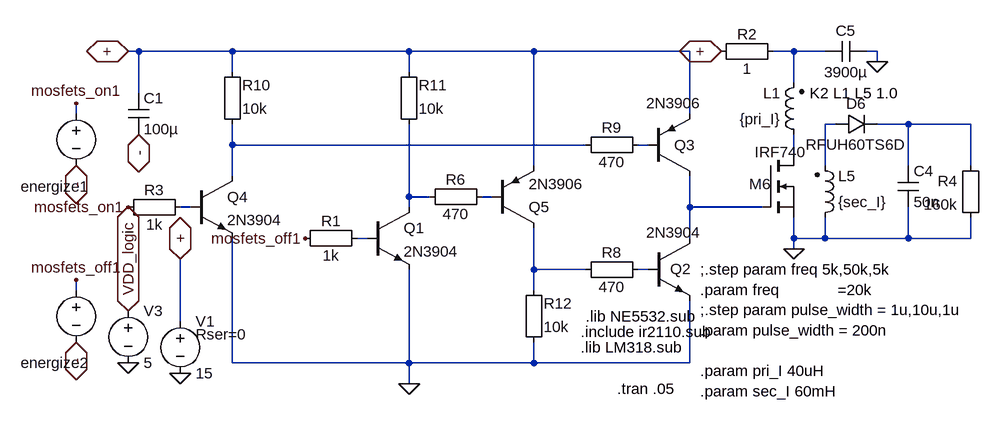
[diagram p0: schematic metal_SMPS_400v_2.asc]
metal_SMPS_400v_2.asc, the LTspice schematic file:
Version 4
SHEET 1 6068 1612
WIRE 2240 -2528 2224 -2528
WIRE 2384 -2528 2240 -2528
WIRE 2656 -2528 2384 -2528
WIRE 2848 -2528 2656 -2528
WIRE 3088 -2528 2848 -2528
WIRE 3248 -2528 3216 -2528
WIRE 3296 -2528 3248 -2528
WIRE 3376 -2528 3360 -2528
WIRE 3376 -2512 3376 -2528
WIRE 2384 -2496 2384 -2528
WIRE 2656 -2496 2656 -2528
WIRE 3248 -2480 3248 -2528
WIRE 2240 -2464 2240 -2528
WIRE 2144 -2432 2144 -2448
WIRE 3088 -2432 3088 -2528
WIRE 3312 -2416 3296 -2416
WIRE 3424 -2416 3376 -2416
WIRE 3520 -2416 3424 -2416
WIRE 2384 -2384 2384 -2416
WIRE 2928 -2384 2384 -2384
WIRE 3024 -2384 3008 -2384
WIRE 3248 -2368 3248 -2400
WIRE 2848 -2352 2848 -2528
WIRE 3296 -2352 3296 -2416
WIRE 3424 -2352 3424 -2416
WIRE 3520 -2352 3520 -2416
WIRE 2384 -2336 2384 -2384
WIRE 2656 -2304 2656 -2416
WIRE 2688 -2304 2656 -2304
WIRE 2784 -2304 2768 -2304
WIRE 2320 -2288 2304 -2288
WIRE 2656 -2288 2656 -2304
WIRE 3088 -2288 3088 -2336
WIRE 3200 -2288 3088 -2288
WIRE 2592 -2240 2576 -2240
WIRE 3088 -2240 3088 -2288
WIRE 3248 -2240 3248 -2272
WIRE 3296 -2240 3296 -2272
WIRE 3296 -2240 3248 -2240
WIRE 3424 -2240 3424 -2288
WIRE 3424 -2240 3296 -2240
WIRE 3520 -2240 3520 -2272
WIRE 3520 -2240 3424 -2240
WIRE 3248 -2224 3248 -2240
WIRE 2848 -2192 2848 -2256
WIRE 2928 -2192 2848 -2192
WIRE 3024 -2192 3008 -2192
WIRE 2144 -2160 2144 -2176
WIRE 2848 -2160 2848 -2192
WIRE 2304 -2112 2304 -2208
WIRE 2384 -2048 2384 -2240
WIRE 2656 -2048 2656 -2192
WIRE 2656 -2048 2384 -2048
WIRE 2848 -2048 2848 -2080
WIRE 2848 -2048 2656 -2048
WIRE 3088 -2048 3088 -2144
WIRE 3088 -2048 2848 -2048
WIRE 2656 -2016 2656 -2048
FLAG 3248 -2224 0
FLAG 2224 -2048 0
FLAG 2224 -2128 VDD_logic
IOPIN 2224 -2128 BiDir
FLAG 2304 -2208 +
IOPIN 2304 -2208 BiDir
FLAG 2304 -2032 0
FLAG 2144 -2352 -
IOPIN 2144 -2352 BiDir
FLAG 2144 -2448 mosfets_on1
FLAG 2144 -2080 -
IOPIN 2144 -2080 BiDir
FLAG 2144 -2176 mosfets_off1
FLAG 2240 -2400 -
IOPIN 2240 -2400 BiDir
FLAG 2224 -2288 mosfets_on1
FLAG 2496 -2240 mosfets_off1
FLAG 2224 -2528 +
IOPIN 2224 -2528 BiDir
FLAG 2656 -2016 0
FLAG 3376 -2512 0
FLAG 3136 -2528 +
IOPIN 3136 -2528 BiDir
SYMBOL ind2 3280 -2256 M180
WINDOW 0 36 80 Left 2
WINDOW 3 36 40 Left 2
SYMATTR InstName L5
SYMATTR Value {sec_I}
SYMATTR SpiceLine Rser=.42
SYMATTR Type ind
SYMBOL diode 3312 -2400 R270
WINDOW 0 32 32 VTop 2
WINDOW 3 0 32 VBottom 2
SYMATTR InstName D6
SYMATTR Value RFUH60TS6D
SYMBOL Misc\\EuropeanCap 3408 -2352 R0
SYMATTR InstName C4
SYMATTR Value 50n
SYMBOL Misc\\EuropeanResistor 3536 -2368 M0
SYMATTR InstName R4
SYMATTR Value 160k
SYMBOL nmos 3200 -2368 R0
WINDOW 0 -21 44 Left 2
WINDOW 3 -12 -5 Left 2
SYMATTR InstName M6
SYMATTR Value IRF740
SYMBOL ind2 3264 -2384 R180
WINDOW 0 36 80 Left 2
WINDOW 3 36 40 Left 2
SYMATTR InstName L1
SYMATTR Value {pri_I}
SYMATTR SpiceLine Rser=.0003
SYMATTR Type ind
SYMBOL voltage 2224 -2144 R0
WINDOW 123 0 0 Left 2
SYMATTR SpiceLine Rser=20
SYMATTR InstName V3
SYMATTR Value 5
SYMBOL voltage 2304 -2128 R0
WINDOW 123 0 0 Left 2
WINDOW 39 24 36 Left 2
SYMATTR SpiceLine Rser=0
SYMATTR InstName V1
SYMATTR Value 15
SYMBOL Misc\\EuropeanCap 2224 -2464 R0
SYMATTR InstName C1
SYMATTR Value 100µ
SYMATTR SpiceLine V=400 Irms=1 Rser=.32 Lser=0
SYMBOL npn3 2592 -2288 R0
SYMATTR InstName Q1
SYMATTR Value 2N3904
SYMBOL Misc\\EuropeanResistor 2480 -2256 M90
WINDOW 0 5 56 VBottom 2
WINDOW 3 27 56 VTop 2
SYMATTR InstName R1
SYMATTR Value 1k
SYMBOL npn3 3024 -2240 R0
WINDOW 0 34 47 Left 2
WINDOW 3 -3 -9 Left 2
SYMATTR InstName Q2
SYMATTR Value 2N3904
SYMBOL pnp2 3024 -2336 M180
WINDOW 0 40 48 Left 2
WINDOW 3 -3 112 Left 2
SYMATTR InstName Q3
SYMATTR Value 2N3906
SYMBOL npn3 2320 -2336 R0
SYMATTR InstName Q4
SYMATTR Value 2N3904
SYMBOL Misc\\EuropeanResistor 2208 -2304 M90
WINDOW 0 5 56 VBottom 2
WINDOW 3 27 56 VTop 2
SYMATTR InstName R3
SYMATTR Value 1k
SYMBOL pnp2 2784 -2256 M180
SYMATTR InstName Q5
SYMATTR Value 2N3906
SYMBOL Misc\\EuropeanResistor 2672 -2320 M90
WINDOW 0 5 56 VBottom 2
WINDOW 3 27 56 VTop 2
SYMATTR InstName R6
SYMATTR Value 470
SYMBOL Misc\\EuropeanResistor 3024 -2176 M270
WINDOW 0 27 56 VTop 2
WINDOW 3 5 56 VBottom 2
SYMATTR InstName R8
SYMATTR Value 470
SYMBOL Misc\\EuropeanResistor 2912 -2400 M90
WINDOW 0 5 56 VBottom 2
WINDOW 3 27 56 VTop 2
SYMATTR InstName R9
SYMATTR Value 470
SYMBOL Misc\\EuropeanResistor 2368 -2400 M180
WINDOW 0 31 76 Left 2
WINDOW 3 31 40 Left 2
SYMATTR InstName R10
SYMATTR Value 10k
SYMBOL Misc\\EuropeanResistor 2640 -2400 M180
WINDOW 0 31 76 Left 2
WINDOW 3 31 40 Left 2
SYMATTR InstName R11
SYMATTR Value 10k
SYMBOL Misc\\EuropeanResistor 2832 -2064 M180
WINDOW 0 31 76 Left 2
WINDOW 3 31 40 Left 2
SYMATTR InstName R12
SYMATTR Value 10k
SYMBOL voltage 2144 -2176 M0
WINDOW 0 -21 128 Left 2
WINDOW 3 -134 119 Invisible 2
WINDOW 123 0 0 Left 2
SYMATTR InstName energize2
SYMATTR Value PULSE(0 4.8 {pulse_width} 10n 10n 20n {1/freq})
SYMATTR SpiceLine Rser=0
SYMBOL voltage 2144 -2448 M0
WINDOW 0 -21 128 Left 2
WINDOW 3 -134 119 Invisible 2
WINDOW 123 0 0 Left 2
SYMATTR InstName energize1
SYMATTR Value PULSE(0 4.8 0 10n 10n 20n {1/freq})
SYMATTR SpiceLine Rser=0
SYMBOL Misc\\EuropeanCap 3360 -2544 R90
WINDOW 0 0 32 VBottom 2
WINDOW 3 32 32 VTop 2
SYMATTR InstName C5
SYMATTR Value 3900µ
SYMATTR SpiceLine Rser=.005
SYMBOL Misc\\EuropeanResistor 3120 -2544 M90
WINDOW 0 5 56 VBottom 2
WINDOW 3 27 56 VTop 2
SYMATTR InstName R2
SYMATTR Value 1
TEXT 3104 -2192 Left 2 !;.step param freq 5k,50k,5k\n.param freq             =20k\n;.step param pulse_width = 1u,10u,1u\n.param pulse_width = 200n\n \n.param pri_I 40uH\n.param sec_I 60mH
TEXT 2928 -2120 Left 2 !.lib NE5532.sub
TEXT 2920 -2072 Left 2 !.lib LM318.sub
TEXT 2920 -2096 Left 2 !.include ir2110.sub
TEXT 2976 -2008 Left 2 !.tran .05
TEXT 3272 -2464 Left 2 !K2 L1 L5 1.0

The netlist it stands for:
* metal_SMPS_400v_2.asc
L5 0 N002 {sec_I} Rser=.42
D6 N002 N003 RFUH60TS6D
C4 N003 0 50n
R4 N003 0 160k
M6 N006 N010 0 0 IRF740
L1 N006 N001 {pri_I} Rser=.0003
V3 VDD_logic 0 5 Rser=20
V1 + 0 15 Rser=0
C1 + - 100µ V=400 Irms=1 Rser=.32 Lser=0
Q1 N007 N011 0 0 2N3904
R1 mosfets_off1 N011 1k
Q2 N010 N013 0 0 2N3904
Q3 N010 N005 + 0 2N3906
Q4 N004 N009 0 0 2N3904
R3 mosfets_on1 N009 1k
Q5 N012 N008 + 0 2N3906
R6 N007 N008 470
R8 N013 N012 470
R9 N004 N005 470
R10 N004 + 10k
R11 N007 + 10k
R12 0 N012 10k
V§energize2 mosfets_off1 - PULSE(0 4.8 {pulse_width} 10n 10n 20n {1/freq}) Rser=0
V§energize1 mosfets_on1 - PULSE(0 4.8 0 10n 10n 20n {1/freq}) Rser=0
C5 0 N001 3900µ Rser=.005
R2 + N001 1
.model D D
.lib standard.dio
.model NPN NPN
.model PNP PNP
.lib standard.bjt
.model NMOS NMOS
.model PMOS PMOS
.lib standard.mos
;.step param freq 5k,50k,5k
.param freq             =20k
;.step param pulse_width = 1u,10u,1u
.param pulse_width = 200n
.param pri_I 40uH
.param sec_I 60mH
.lib NE5532.sub
.lib LM318.sub
.include ir2110.sub
.tran .05
K2 L1 L5 1.0
.backanno
.end